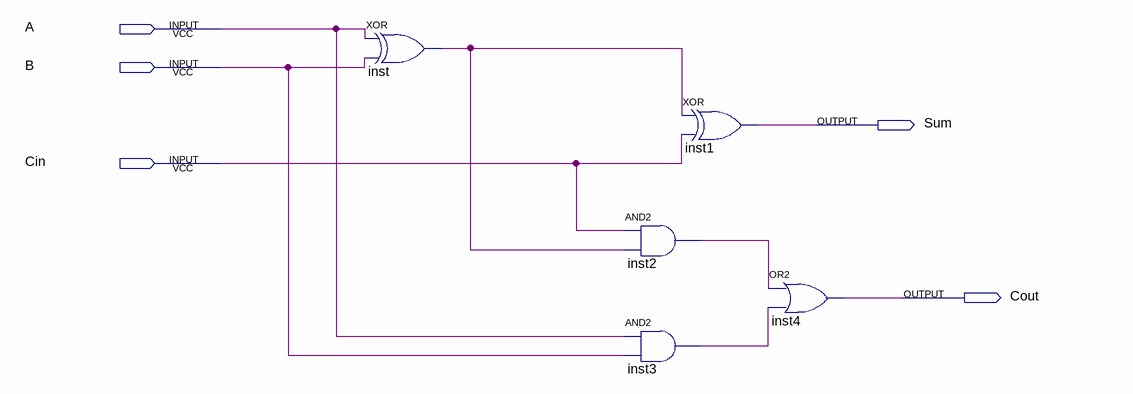
[diagram p0: schematic sheet]
// Quartus schematic lab3assignment.bdf as structural Verilog: 5 symbols, 5 pins
module lab3assignment (
  input  A,
  input  B,
  input  Cin,
  output Sum,
  output Cout
);

  wire inst2_out, inst3_out, inst_out;

  xor inst (inst_out, A, B);
  and inst2 (inst2_out, Cin, inst_out);
  and inst3 (inst3_out, A, B);
  xor inst1 (Sum, inst_out, Cin);
  or inst4 (Cout, inst2_out, inst3_out);
endmodule
